# Altium project PUA.PrjPcb (part 8 of 14)

## Sheet Private_CPU_Reset_IO.SchDoc
size D
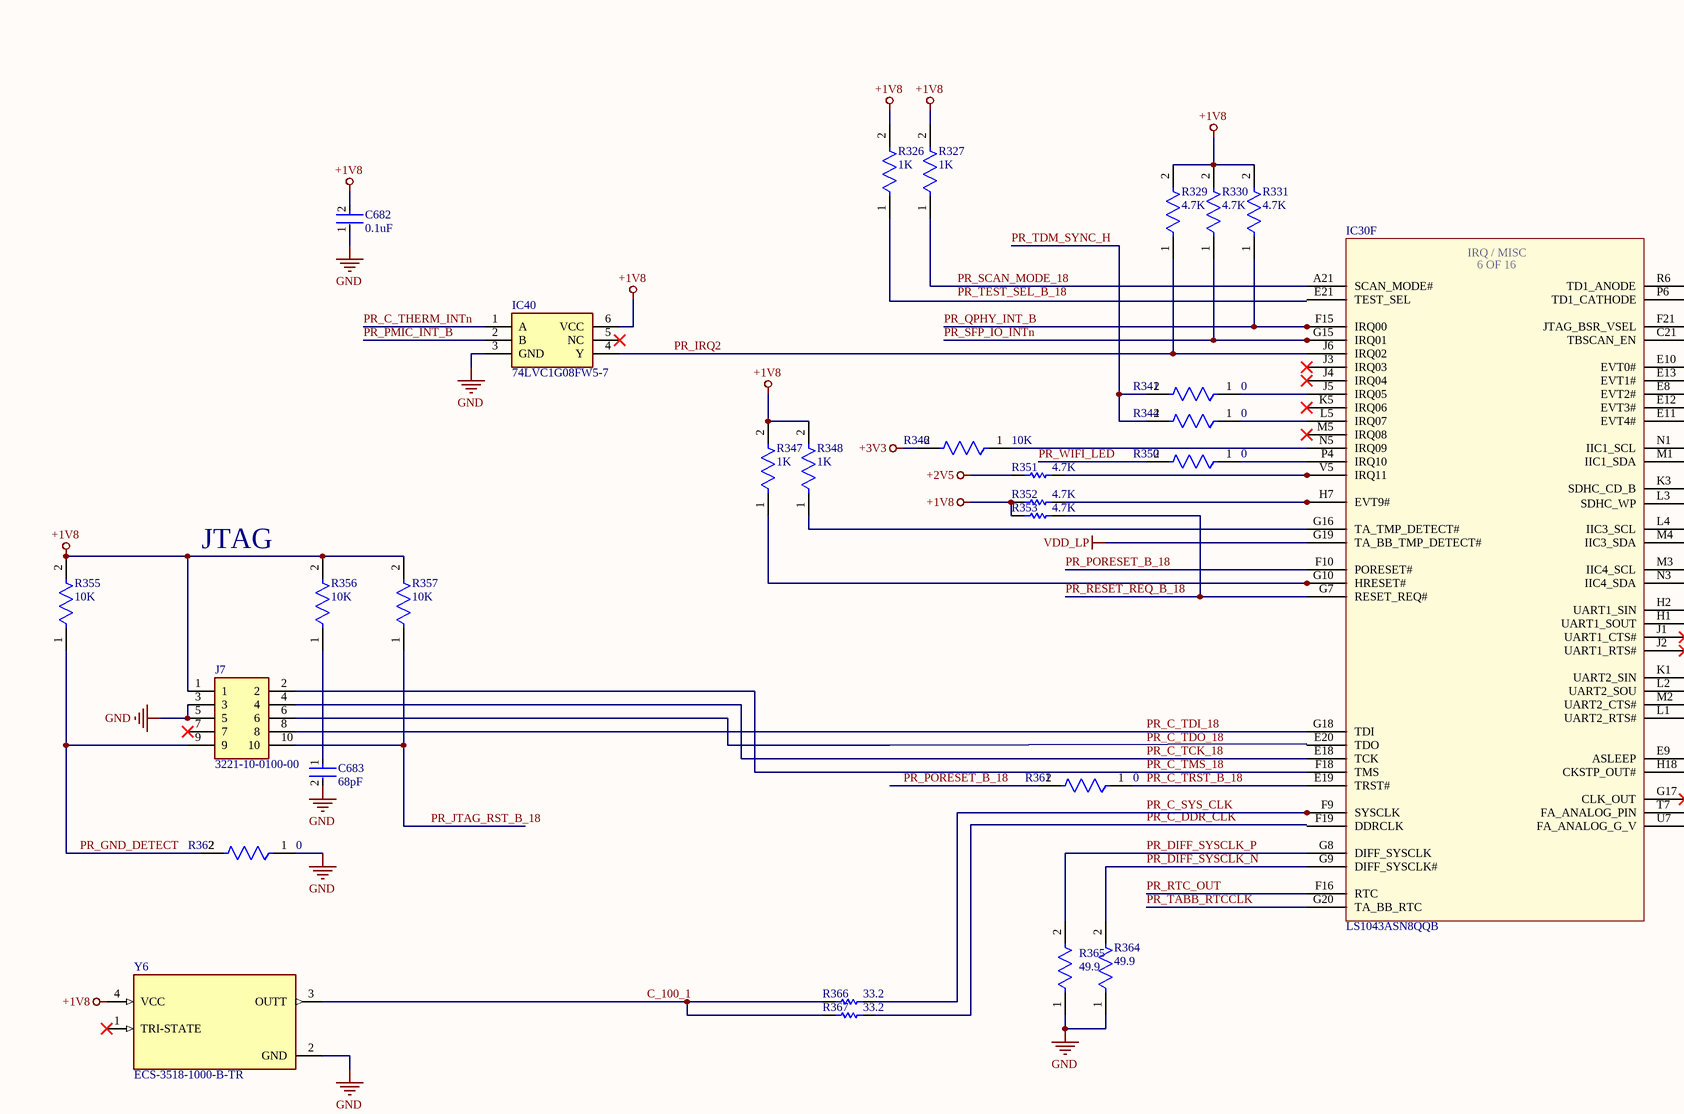
[diagram p32: Private_CPU_Reset_IO.SchDoc, top left]
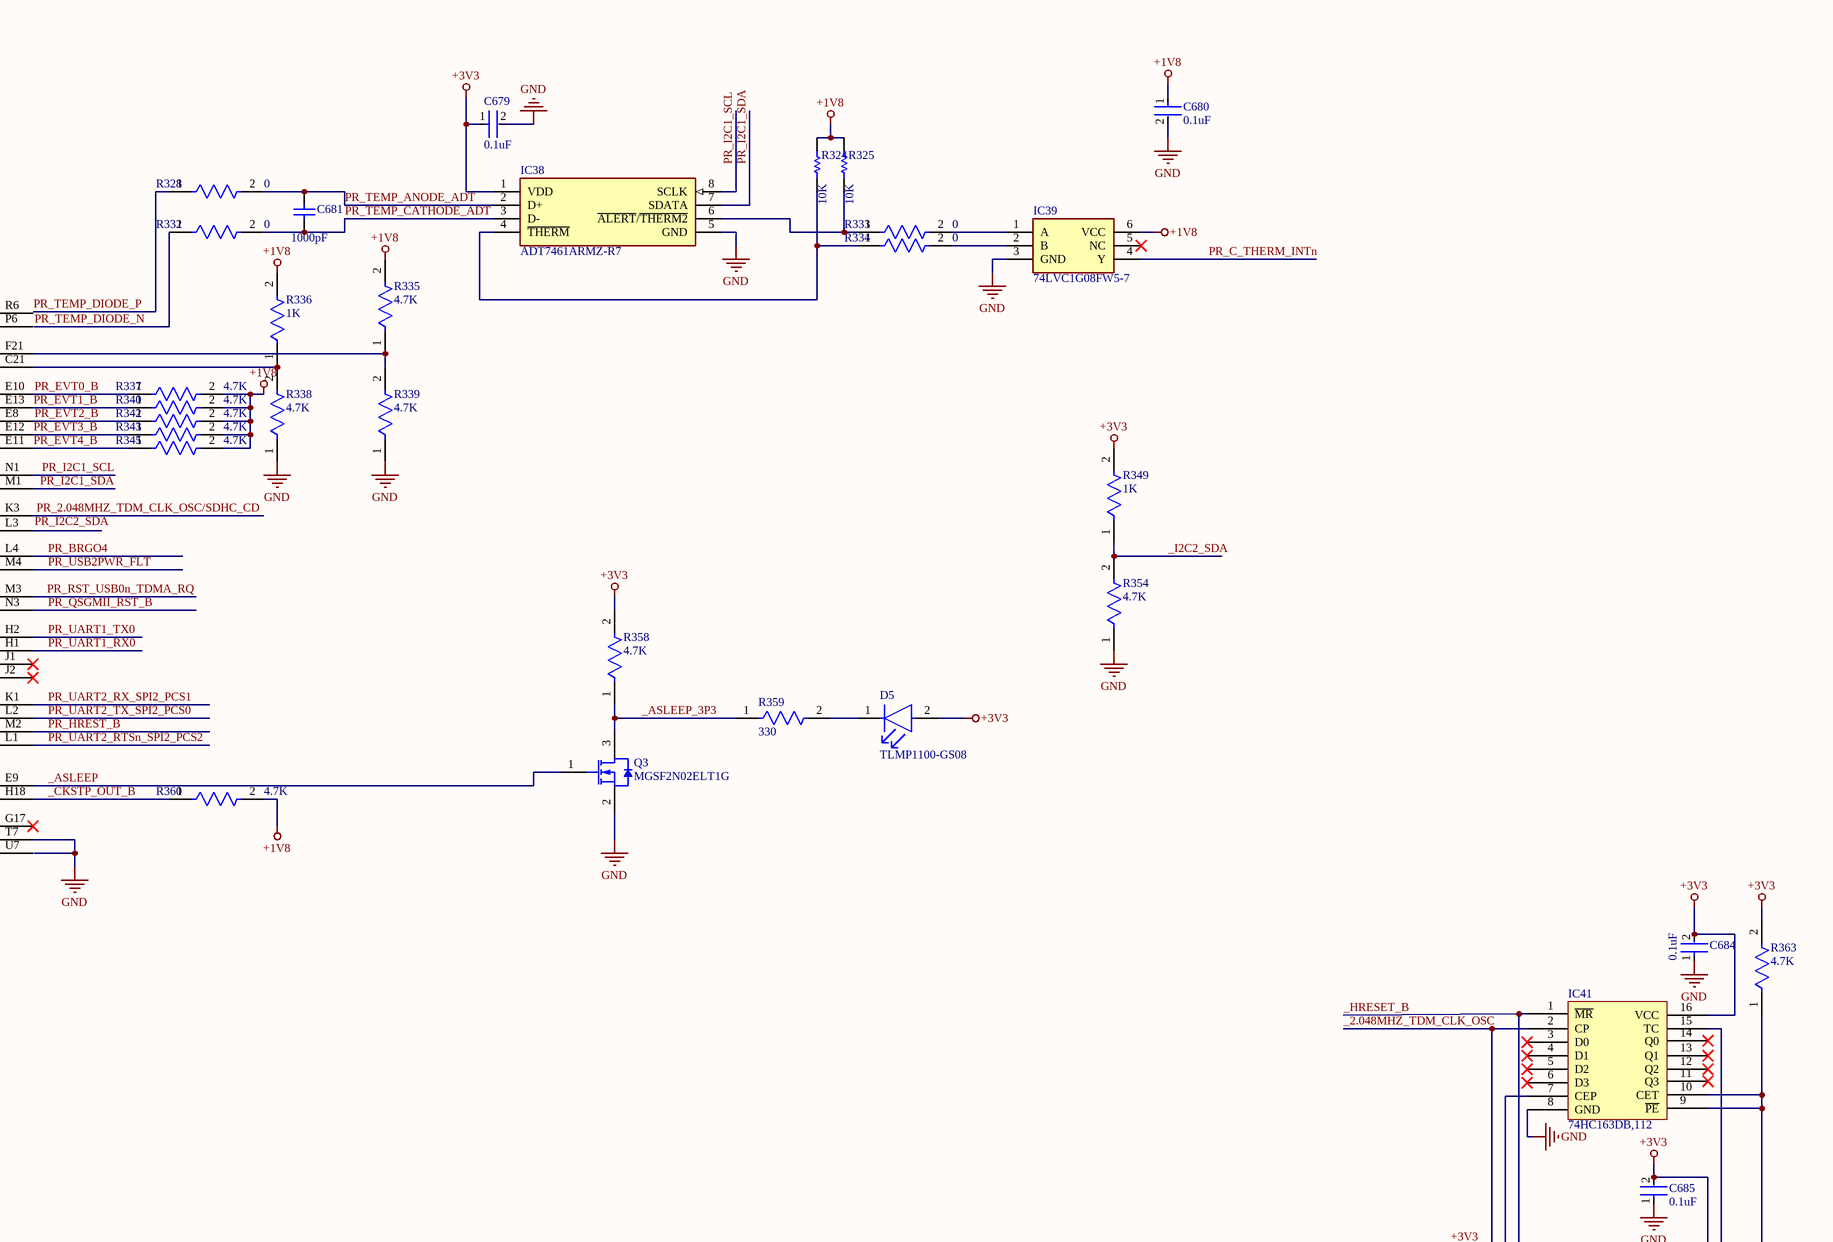
[diagram p33: Private_CPU_Reset_IO.SchDoc, top right]
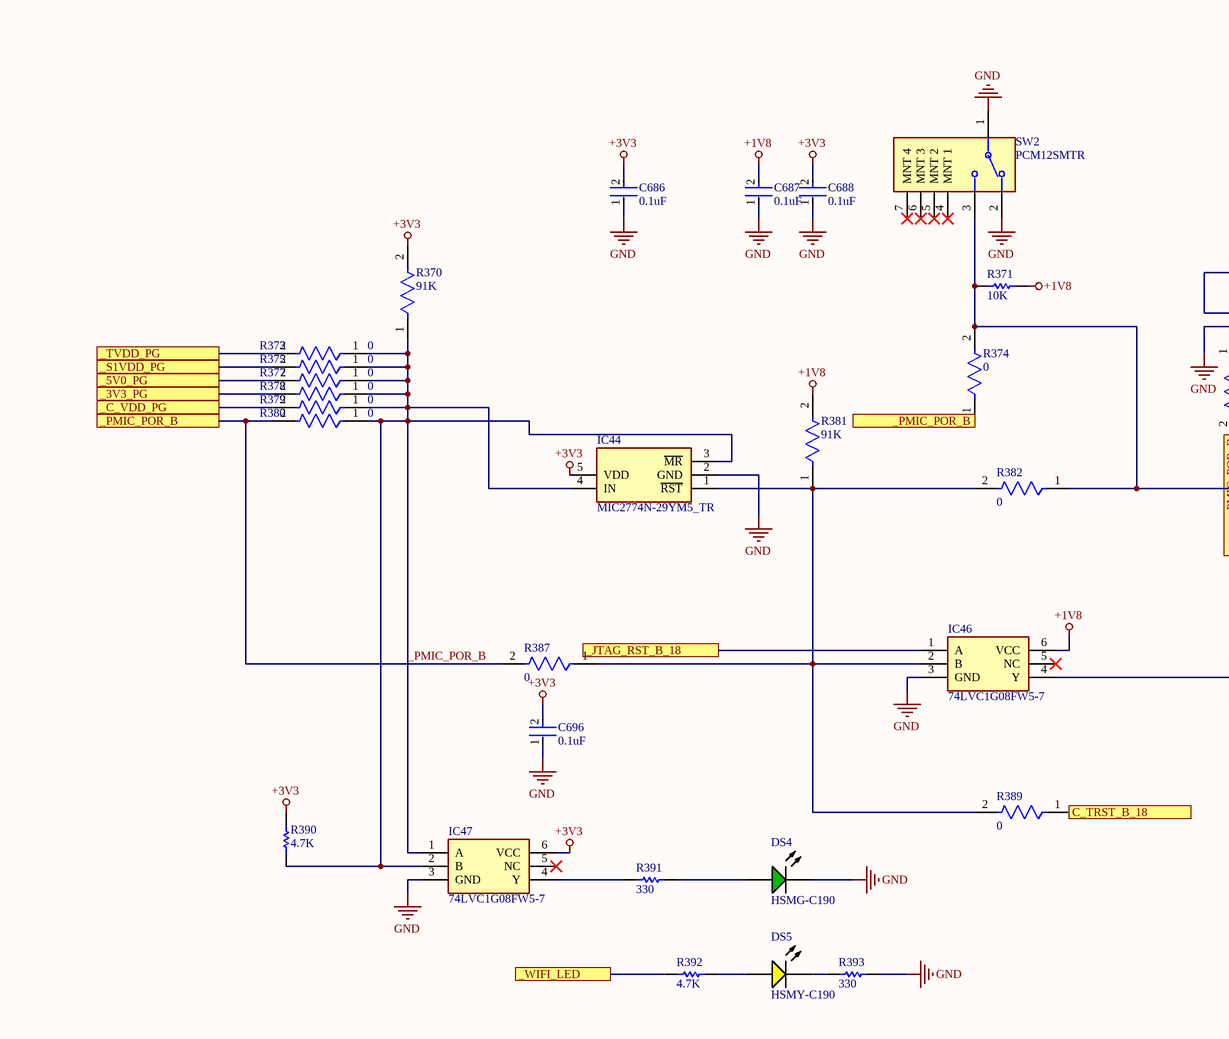
[diagram p34: Private_CPU_Reset_IO.SchDoc, bottom left]
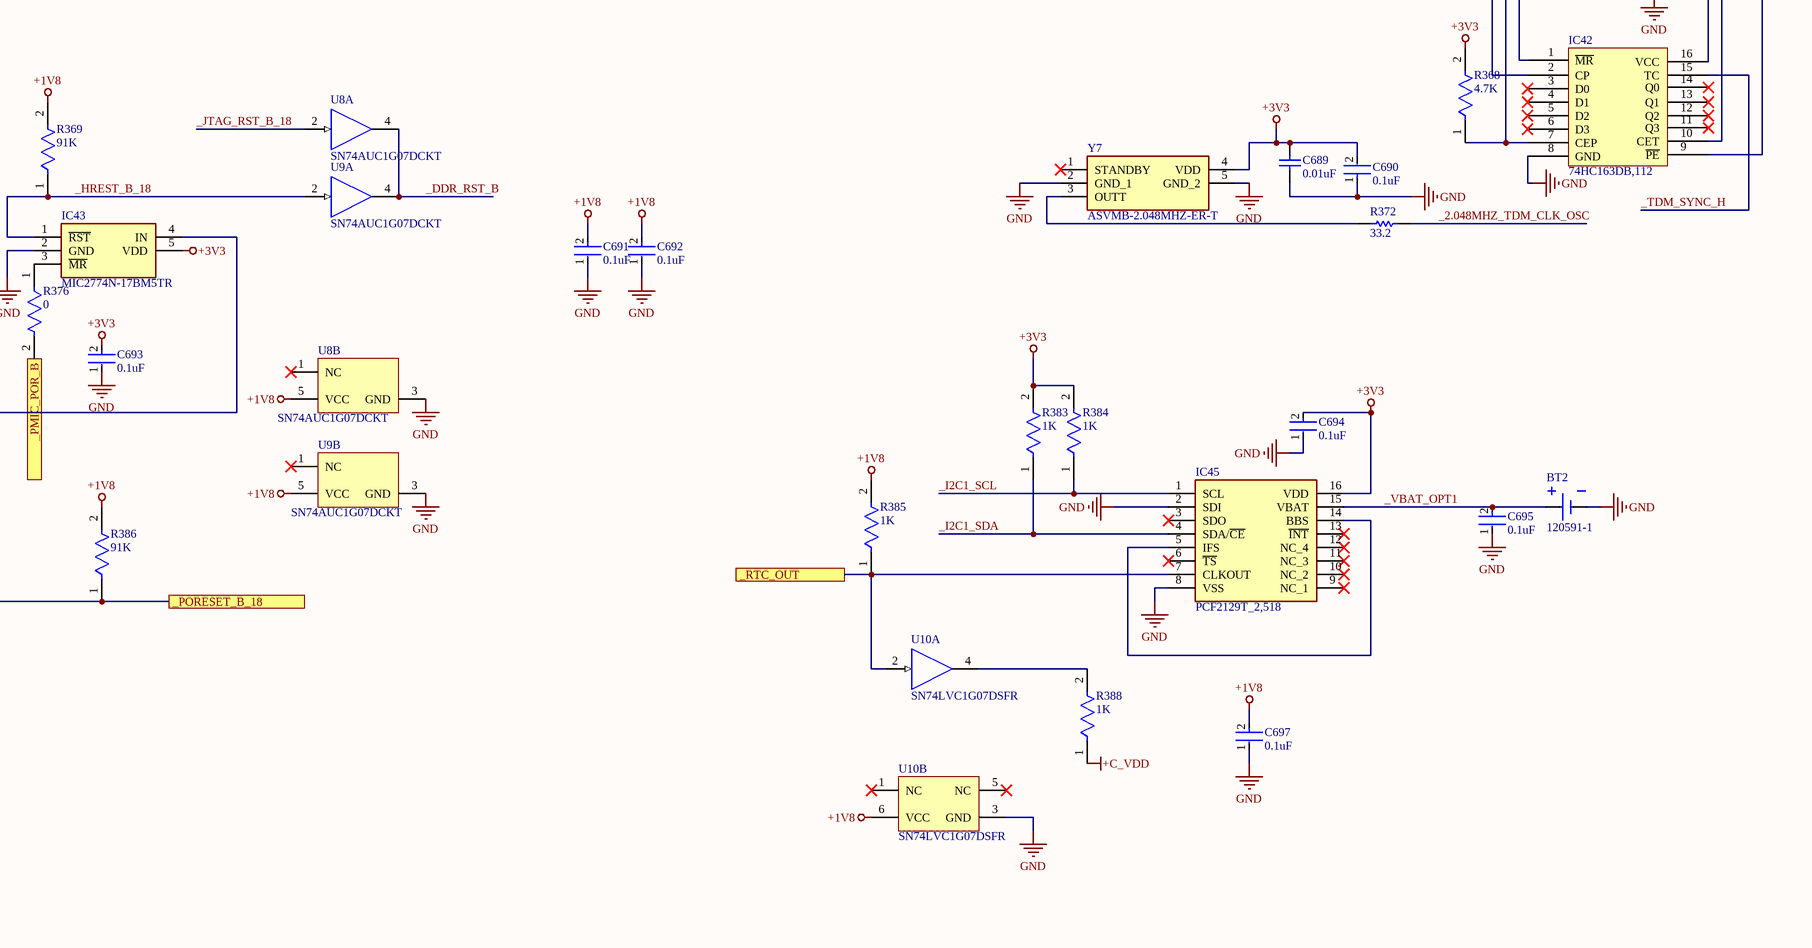
[diagram p35: Private_CPU_Reset_IO.SchDoc, bottom right]

### Parts
BT2  120591-1  [TECO-120591-1-2_V]
C679  0.1uF  [FP-C0402-BB-MFG]
C680  0.1uF  [FP-C0402-BB-MFG]
C681  1000pF  [CAPC1005X55X25ML5T10]
C682  0.1uF  [FP-GRM15-MFG]
C683  68pF  [FP-C0805C-DN-MFG]
C684  0.1uF  [FP-C0402-BB-MFG]
C685  0.1uF  [FP-C0402-BB-MFG]
C686  0.1uF  [FP-GRM15-MFG]
C687  0.1uF  [FP-GRM15-MFG]
C688  0.1uF  [FP-GRM15-MFG]
C689  0.01uF  [CAPC1005X56X25LL10T15]
C690  0.1uF  [FP-C0402-BB-MFG]
C691  0.1uF  [FP-GRM15-MFG]
C692  0.1uF  [FP-GRM15-MFG]
C693  0.1uF  [FP-GRM15-MFG]
C694  0.1uF  [FP-GRM15-MFG]
C695  0.1uF  [FP-GRM15-MFG]
C696  0.1uF  [FP-GRM15-MFG]
C697  0.1uF  [FP-GRM15-MFG]
D5  TLMP1100-GS08  [FP-6_541-5056_01-4-MFG]
DS4  HSMG-C190  [AVAG-HSMX-C190_V]
DS5  HSMY-C190  [AVAG-HSMX-C190_V]
IC30  LS1043ASN8QQB  [BGA780C80P28X28_2300X2300X261]  (part F of 16)
IC38  ADT7461ARMZ-R7  [SOP65P490X110-8N]
IC39  74LVC1G08FW5-7  [74LVC1G08FW57]
IC40  74LVC1G08FW5-7  [74LVC1G08FW57]
IC41  74HC163DB,112  [SOP65P775X200-16N]
IC42  74HC163DB,112  [SOP65P775X200-16N]
IC43  MIC2774N-17BM5TR  [SOT95P280X145-5N]
IC44  MIC2774N-29YM5_TR  [SOT95P280X145-5N]
IC45  PCF2129T_2,518  [SOIC127P1032X265-16N]
IC46  74LVC1G08FW5-7  [74LVC1G08FW57]
IC47  74LVC1G08FW5-7  [74LVC1G08FW57]
J7  3221-10-0100-00  [CNC_3221-10-0100-00]
Q3  MGSF2N02ELT1G  [ONSC-SOT-23-3-318-08_V]
R324  10K  [RESC1005X40X25NL05T05]
R325  10K  [RESC1005X40X25NL05T05]
R326  1K  [FP-CRCW0402-e3-MFG]
R327  1K  [FP-CRCW0402-e3-MFG]
R328  0  [FP-CRCW0402-e3-IPC_C]
R329  4.7K  [FP-CRCW0402-e3-IPC_B]
R330  4.7K  [FP-CRCW0402-e3-IPC_B]
R331  4.7K  [FP-CRCW0402-e3-IPC_B]
R332  0  [FP-CRCW0402-e3-IPC_C]
R333  0  [FP-CRCW0402-e3-IPC_C]
R334  0  [FP-CRCW0402-e3-IPC_C]
R335  4.7K  [FP-CRCW0402-e3-IPC_B]
R336  1K  [FP-CRCW0402-e3-MFG]
R337  4.7K  [FP-CRCW0402-e3-IPC_B]
R338  4.7K  [FP-CRCW0402-e3-IPC_B]
R339  4.7K  [FP-CRCW0402-e3-IPC_B]
R340  4.7K  [FP-CRCW0402-e3-IPC_B]
R341  0  [FP-CRCW0402-e3-IPC_C]
R342  4.7K  [FP-CRCW0402-e3-IPC_B]
R343  4.7K  [FP-CRCW0402-e3-IPC_B]
R344  0  [FP-CRCW0402-e3-IPC_C]
R345  4.7K  [FP-CRCW0402-e3-IPC_B]
R346  10K  [FP-CRCW0402-e3-IPC_B]
R347  1K  [FP-CRCW0402-e3-MFG]
R348  1K  [FP-CRCW0402-e3-MFG]
R349  1K  [FP-CRCW0402-e3-MFG]
R350  0  [FP-CRCW0402-e3-IPC_C]
R351  4.7K  [RESC1005X40X25LL05T05]
R352  4.7K  [RESC1005X40X25LL05T05]
R353  4.7K  [RESC1005X40X25LL05T05]
R354  4.7K  [FP-CRCW0402-e3-IPC_B]
R355  10K  [FP-CRCW0402-e3-IPC_B]
R356  10K  [FP-CRCW0402-e3-IPC_B]
R357  10K  [FP-CRCW0402-e3-IPC_B]
R358  4.7K  [FP-CRCW0402-e3-IPC_B]
R359  330  [FP-CRCW0402-e3-MFG]
R360  4.7K  [FP-CRCW0402-e3-IPC_B]
R361  0  [FP-CRCW0402-e3-IPC_C]
R362  0  [FP-CRCW0402-e3-IPC_C]
R363  4.7K  [FP-CRCW0402-e3-IPC_B]
R364  49.9  [FP-CRCW0402-e3-MFG]
R365  49.9  [FP-CRCW0402-e3-MFG]
R366  33.2  [RESC1005X40X25LL05T05]
R367  33.2  [RESC1005X40X25LL05T05]
R368  4.7K  [FP-CRCW0402-e3-IPC_B]
R369  91K  [FP-CRCW0402-e3-IPC_B]
R370  91K  [FP-CRCW0402-e3-IPC_B]
R371  10K  [RESC1005X40X25NL05T05]
R372  33.2  [RESC1005X40X25ML05T05]
R373  0  [FP-CRCW0402-e3-IPC_C]
R374  0  [FP-CRCW0402-e3-IPC_C]
R375  0  [FP-CRCW0402-e3-IPC_C]
R376  0  [FP-CRCW0402-e3-IPC_C]
R377  0  [FP-CRCW0402-e3-IPC_C]
R378  0  [FP-CRCW0402-e3-IPC_C]
R379  0  [FP-CRCW0402-e3-IPC_C]
R380  0  [FP-CRCW0402-e3-IPC_C]
R381  91K  [FP-CRCW0402-e3-IPC_B]
R382  0  [FP-CRCW0402-e3-IPC_C]
R383  1K  [FP-CRCW0402-e3-MFG]
R384  1K  [FP-CRCW0402-e3-MFG]
R385  1K  [FP-CRCW0402-e3-MFG]
R386  91K  [FP-CRCW0402-e3-IPC_B]
R387  0  [FP-CRCW0402-e3-IPC_C]
R388  1K  [FP-CRCW0402-e3-MFG]
R389  0  [FP-CRCW0402-e3-IPC_C]
R390  4.7K  [RESC1005X40X25LL05T05]
R391  330  [RESC1608X55X30LL15T15]
R392  4.7K  [RESC1005X40X25LL05T05]
R393  330  [RESC1608X55X30LL15T15]
SW2  PCM12SMTR  [FP-PCM12SMTR-MFG]
U8  SN74AUC1G07DCKT  [DCK0005A_M]  (parts A,B of 2)
U9  SN74AUC1G07DCKT  [DCK0005A_M]  (parts A,B of 2)
U10  SN74LVC1G07DSFR  [DSF0006A_V]  (parts A,B of 2)
Y6  ECS-3518-1000-B-TR  [OSC_ECS-3518-1000-B-TR]
Y7  ASVMB-2.048MHZ-ER-T  [ASVMB2048MHZERT]

### Ports
_3V3_PG, _5V0_PG, _C_VDD_PG, _JTAG_RST_B_18, _PMIC_POR_B, _PORESET_B_18, _RTC_OUT, _S1VDD_PG, _TVDD_PG, _WIFI_LED, C_TRST_B_18

### Nets
+1V8: C680.1 C682.2 C687.2 C691.2 C692.2 C697.2 IC39.6(VCC) IC40.6(VCC) IC46.6(VCC) J7.1 R324.2 R325.2 R326.2 R327.2 R329.2 R330.2 R331.2 R335.2 R336.2 R337.2 R340.2 R342.2 R343.2 R345.2 R347.2 R348.2 R352.2 R353.2 R355.2 R356.2 R357.2 R360.2 R369.2 R371.1 R381.2 R385.2 R386.2 U8.5(VCC) U9.5(VCC) U10.6(VCC) Y6.4(VCC)
+2V5: R351.2
+3V3: C679.1 C684.2 C685.2 C686.2 C688.2 C689.2 C690.2 C693.2 C694.2 C696.2 D5.2(A) IC38.1(VDD) IC41.16(VCC) IC42.16(VCC) IC43.5(VDD) IC44.5(VDD) IC45.16(VDD) IC47.6(VCC) R346.2 R349.2 R358.2 R363.2 R368.2 R370.2 R383.2 R384.2 R390.2 Y7.4(VDD)
+C_VDD: R388.1
GND: BT2.2(-) C679.2 C680.2 C682.1 C683.2 C684.1 C685.1 C686.1 C687.1 C688.1 C689.1 C690.1 C691.1 C692.1 C693.1 C694.1 C695.1 C696.1 C697.1 DS4.2(K) IC30.T7(FA_ANALOG_PIN) IC38.5(GND) IC39.3(GND) IC40.3(GND) IC41.8(GND) IC42.8(GND) IC43.2(GND) IC44.2(GND) IC45.2(SDI) IC45.8(VSS) IC46.3(GND) IC47.3(GND) J7.3 J7.5 Q3.2(S) R338.1 R339.1 R354.1 R362.1 R364.1 R365.1 R393.2 SW2.1 SW2.2 U8.3(GND) U9.3(GND) U10.3(GND) Y6.2(GND) Y7.2(GND_1) Y7.5(GND_2)
VDD_LP: IC30.G19(TA_BB_TMP_DETECT#)
_2.048MHZ_TDM_CLK_OSC: IC41.2(CP) IC42.2(CP) R372.2
_ASLEEP: IC30.E9(ASLEEP) Q3.1(G)
_ASLEEP_3P3: Q3.3(D) R358.1 R359.1
_CKSTP_OUT_B: IC30.H18(CKSTP_OUT#) R360.1
_DDR_RST_B: U8.4(Y) U9.4(Y)
_HRESET_B: IC41.1(~{MR}) IC42.1(~{MR})
_HREST_B_18: IC43.1(~{RST}) R369.1 U9.2(A)
_I2C1_SCL: IC45.1(SCL) R384.1
_I2C1_SDA: IC45.4(SDA/~{CE}) R383.1
_I2C2_SDA: R349.1 R354.2
_JTAG_RST_B_18: U8.2(A)
_PMIC_POR_B: IC44.3(~{MR}) IC44.4(IN) IC47.1(A) IC47.2(B) R370.1 R373.1 R374.1 R375.1 R376.2 R377.1 R378.1 R379.1 R380.1 R380.2 R387.2 R390.1 ; port _PMIC_POR_B
_TDM_SYNC_H: IC42.15(TC)
_VBAT_OPT1: BT2.1(+) C695.2 IC45.15(VBAT)
C_100_1: R366.1 R367.1 Y6.3(OUTT)
PR_2.048MHZ_TDM_CLK_OSC/SDHC_CD: IC30.K3(SDHC_CD_B)
PR_BRGO4: IC30.L4(IIC3_SCL)
PR_C_DDR_CLK: R367.2
PR_C_SYS_CLK: IC30.F9(SYSCLK) R366.2
PR_C_TCK_18: IC30.E18(TCK) J7.4
PR_C_TDI_18: IC30.G18(TDI) J7.8
PR_C_THERM_INTn: IC39.4(Y) IC40.1(A)
PR_C_TMS_18: IC30.F18(TMS) J7.2
PR_C_TRST_B_18: IC30.E19(TRST#) R361.1
PR_DIFF_SYSCLK_N: IC30.G9(DIFF_SYSCLK#) R364.2
PR_DIFF_SYSCLK_P: IC30.G8(DIFF_SYSCLK) R365.2
PR_EVT0_B: IC30.E10(EVT0#) R337.1
PR_EVT1_B: IC30.E13(EVT1#) R340.1
PR_EVT2_B: IC30.E8(EVT2#) R342.1
PR_EVT3_B: IC30.E12(EVT3#) R343.1
PR_EVT4_B: IC30.E11(EVT4#) R345.1
PR_GND_DETECT: J7.9 R355.1 R362.2
PR_HREST_B: IC30.M2(UART2_CTS#)
PR_I2C1_SCL: IC30.N1(IIC1_SCL) IC38.8(SCLK)
PR_I2C1_SDA: IC30.M1(IIC1_SDA) IC38.7(SDATA)
PR_IRQ2: IC30.J6(IRQ02) IC40.4(Y) R329.1
PR_JTAG_RST_B_18: J7.10 R357.1
PR_PMIC_INT_B: IC40.2(B)
PR_PORESET_B_18: IC30.F10(PORESET#) R361.2
PR_QPHY_INT_B: IC30.F15(IRQ00) R331.1
PR_QSGMII_RST_B: IC30.N3(IIC4_SDA)
PR_RESET_REQ_B_18: IC30.G7(RESET_REQ#) R353.1
PR_RST_USB0n_TDMA_RQ: IC30.M3(IIC4_SCL)
PR_RTC_OUT: IC30.F16(RTC)
PR_SCAN_MODE_18: IC30.A21(SCAN_MODE#) R327.1
PR_SFP_IO_INTn: IC30.G15(IRQ01) R330.1
PR_TABB_RTCCLK: IC30.G20(TA_BB_RTC)
PR_TDM_SYNC_H: R341.2 R344.2
PR_TEMP_ANODE_ADT: C681.2 IC38.2(D+) R328.2
PR_TEMP_CATHODE_ADT: C681.1 IC38.3(D-) R332.2
PR_TEMP_DIODE_N: R332.1
PR_TEMP_DIODE_P: R328.1
PR_UART1_RX0: IC30.H1(UART1_SOUT)
PR_UART1_TX0: IC30.H2(UART1_SIN)
PR_UART2_RTSn_SPI2_PCS2: IC30.L1(UART2_RTS#)
PR_UART2_RX_SPI2_PCS1: IC30.K1(UART2_SIN)
PR_UART2_TX_SPI2_PCS0: IC30.L2(UART2_SOU)
PR_USB2PWR_FLT: IC30.M4(IIC3_SDA)
PR_WIFI_LED: R350.2
NetC683_1: C683.1 R356.1
NetD5_1: D5.1(C) R359.2
NetDS4_1: DS4.1(A) R391.2
NetDS5_1: DS5.1(A) R392.1
NetDS5_2: DS5.2(K) R393.1
NetIC30_C21: IC30.C21(TBSCAN_EN) R336.1 R338.2
NetIC30_F21: IC30.F21(JTAG_BSR_VSEL) R335.1 R339.2
NetIC30_G10: IC30.G10(HRESET#) R347.1
NetIC30_G16: IC30.G16(TA_TMP_DETECT#) R348.1
NetIC30_H7: IC30.H7(EVT9#) R352.1
NetIC30_J5: IC30.J5(IRQ05) R341.1
NetIC30_L5: IC30.L5(IRQ07) R344.1
NetIC30_N5: IC30.N5(IRQ09) R346.1
NetIC30_P4: IC30.P4(IRQ10) R350.1
NetIC30_V5: IC30.V5(IRQ11) R351.1
NetIC38_4: IC38.4(~{THERM}) R324.1 R334.1
NetIC38_6: IC38.6(~{ALERT}/~{THERM2}) R325.1 R333.1
NetIC39_1: IC39.1(A) R333.2
NetIC39_2: IC39.2(B) R334.2
NetIC41_7: IC41.7(CEP) IC42.7(CEP) R368.1
NetIC41_9: IC41.9(~{PE}) IC41.10(CET) IC42.9(~{PE}) R363.1
NetIC41_15: IC41.15(TC) IC42.10(CET)
NetIC43_3: IC43.3(~{MR}) R376.1
NetIC43_4: IC43.4(IN) R371.2 R374.2 R382.1 SW2.3
NetIC44_1: IC44.1(~{RST}) IC46.2(B) R381.1 R382.2 R387.1 R389.2
NetIC45_5: IC45.5(IFS) IC45.14(BBS)
NetIC45_7: IC45.7(CLKOUT) R385.1 U10.2(A) ; port _RTC_OUT
NetIC46_1: IC46.1(A) ; port _JTAG_RST_B_18
NetIC46_4: IC46.4(Y) R386.1 ; port _PORESET_B_18
NetIC47_4: IC47.4(Y) R391.1
NetR372_1: R372.1 Y7.3(OUTT)
NetR373_2: R373.2 ; port _TVDD_PG
NetR375_2: R375.2 ; port _S1VDD_PG
NetR377_2: R377.2 ; port _5V0_PG
NetR378_2: R378.2 ; port _3V3_PG
NetR379_2: R379.2 ; port _C_VDD_PG
NetR388_2: R388.2 U10.4(Y)
NetR389_1: R389.1 ; port C_TRST_B_18
NetR392_2: R392.2 ; port _WIFI_LED

Not connected (* = marked no-connect by the designer): IC30 E20(TDO) E21(TEST_SEL) F19(DDRCLK) G17(CLK_OUT)* J1(UART1_CTS#)* J2(UART1_RTS#)* J3(IRQ03)* J4(IRQ04)* K5(IRQ06)* L3(SDHC_WP) M5(IRQ08)* P6(TD1_CATHODE) R6(TD1_ANODE) U7(FA_ANALOG_G_V); IC39 5(NC)*; IC40 5(NC)*; IC41 3(D0)* 4(D1)* 5(D2)* 6(D3)* 11(Q3)* 12(Q2)* 13(Q1)* 14(Q0)*; IC42 3(D0)* 4(D1)* 5(D2)* 6(D3)* 11(Q3)* 12(Q2)* 13(Q1)* 14(Q0)*; IC45 3(SDO)* 6(~{TS})* 9(NC_1)* 10(NC_2)* 11(NC_3)* 12(NC_4)* 13(~{INT})*; IC46 5(NC)*; IC47 5(NC)*; J7 6 7*; R326 1; SW2 4(MNT_1)* 5(MNT_2)* 6(MNT_3)* 7(MNT_4)*; U8 1(NC)*; U9 1(NC)*; U10 1(NC)* 5(NC)*; Y6 1(TRI-STATE)*; Y7 1(STANDBY)*

### Notes on the sheet
- JTAG
- Labels drawn without touching a wire or pin: PR_C_TDO_18, PR_I2C2_SDA, PR_TEST_SEL_B_18
- Title
- Size:
- Date:
- File:
- D
- Number:
- Time:
- Revision:
- Sheet
- of
- (in symbol LS1043ASN8QQB, part F) IRQ / MISC; 6 OF 16

### Library data of the parts
BT2 = CMP-0438-00001-2: Lithium Battery Holder for CR2032 3V Cell; Manufacturer: TE Connectivity; Packing Type: Tray; Body Shape: Horizontal Cylindrical; AccessRights: 2147483647; RevisionId: 1; Folder: Unified Components\Components\TE Connectivity\Connectors & Connector Components\Power Products\Battery Interconnection Products\; ContentType: Unified Component; ContentTypeGUID: CB3C11C4-E317-11DF-B822-12313F0024A2; ComponentLink1Description: Manufacturer URL; LifeCycleStateGUID: 61E382EE-6656-4F12-9E24-BE9327104A25; FolderGUID: A6761B51-D489-48A3-9180-F4808F45AB79; PartNumber: 120591-1; LifeCycle: Released; ReleaseDate: 20/08/2013 02:50:22 AM; PackageReference: 120591-1; ComponentLink2URL: http://www.te.com/commerce/DocumentDelivery/DDEController?Action=showdoc&DocId=Customer+Drawing%7F120591%7FH%7Fpdf%7FEnglish%7FENG_CD_120591_H.pdf%7F120591-1; DatasheetVersion: Rev. H, 01/2013; PackageDescription: Lithium Battery Holder; ItemGUID: B2C50140-681E-4F62-8DBB-9728605318CE; ItemHRID: CMP-0438-00001; Mounting Technology: Through Hole; ComponentLink1URL: http://www.te.com/; ComponentLink2Description: Datasheet
C679 C680 C684 C685 C690 = CMP-2008-02046-2: CAP CER 0.1UF 10V X5R 0402; Manufacturer: Kemet; Manufacturer Part Number: C0402C104K8PACTU; Material: Ceramic; Capacitance: 0.10 μF; Temperature Coefficient: 15%; Tolerance: 0.1; Value: 0.10 μF; Package: C0402-BB; Temperature: -55°C to +125°C; ComponentLink2Description: Datasheet; Temperature Characteristic: X5R; Device Class L1: Passive Components; Height: 0.55mm; Lead Free: Yes; ComponentLink2URL: https://content.kemet.com/datasheets/KEM_C1002_X7R_SMD.pdf; Device Class L2: Capacitors; Temperature Range Low: -55°C; Temperature Range High: +125°C; RoHS: TRUE; Octopart: https://octopart.com/c0402c104k8pactu-kemet-140039; Automotive: No; Mouser Description: Capacitor 100 nF 10 VDC 0402; Category: Cap; Voltage Rating: 10 V; Digikey Description: CAP CER 0.1UF 10V X5R 0402; Ipc Land Pattern Name: CAPC10050X50; Device Class L3: Ceramic Capacitors
C681 = CMP-1662-00017-1: Chip Capacitor, 1 nF, +/- 10%, 50 V, -55 to 125 degC, 0402 (1005 Metric), RoHS, Tape and Reel; Case\/Package: 0402; Type (Capacitors): X7R; Voltage Rating (DC): 50 V; Capacitance: 1 nF; Width: 0.5 mm; Pins: 2; REACH SVHC: No SVHC; Length: 1 mm; Height: 0.5 mm; PackageDescription: 2-Pin Surface Mount Device, Body 1 x 0.5 mm; DatasheetVersion: 07/2016; Mount: Surface Mount; ComponentLink2Description: Datasheet; Tolerance: 10%; ComponentLink2URL: http://psearch.en.murata.com/capacitor/product/GRM155R71H102KA01%23.pdf; ComponentLink1URL: http://www.murata.com/; Case Code (Metric): 1005; Package Quantity: 10000; Min Operating Temperature: -55 degC; Max Operating Temperature: 125 degC; Voltage Rating: 50 V; ComponentLink1Description: Manufacturer URL; Packaging: Tape and Reel; Radiation Hardening: No; RoHSCompliant: true; PackageReference: 0402; Mounting Technology: Surface Mount; Case Code (Imperial): 0402
C682 C686-C688 C691-C697 = CMP-2100-03641-2: as C391 on sheet Private_CPU_Power; RoHS: TRUE; Temperature Characteristic: X7R; Octopart: https://octopart.com/grm155r71c104ka88d-murata-196880; Digikey Description: CAP CER 0.1UF 16V X7R 0402; Device Class L3: Ceramic Capacitors; Height: 0.55mm; ComponentLink2Description: Datasheet; Temperature Range Low: -55°C; Ipc Land Pattern Name: CAPC10050X219; ComponentLink2URL: https://search.murata.co.jp/Ceramy/image/img/A01X/G101/ENG/GRM155R71H471KA01-01A.pdf; Device Class L1: Passive Components; Lead Free: yes; Category: Cap; Package: GRM15; Temperature: -55°C to +125°C; Device Class L2: Capacitors; Temperature Range High: +125°C; Mouser Description: 0402 0.1 uF 16V ±10 % Tolerance X7R SMT Multilayer Ceramic Capacitor
C683 = CMP-2007-00438-2: CAP CER 68PF 50V C0G/NP0 0805; Manufacturer Part Number: C0805C680J5GACTU; Manufacturer: KEMET; Temperature Coefficient: 30ppm/°C; Tolerance: 0.05; Temperature Characteristic: C0G; Material: Ceramic; ComponentLink2URL: https://content.kemet.com/datasheets/KEM_C1003_C0G_SMD.pdf; Device Class L1: Passive Components; Device Class L2: Capacitors; Capacitance: 68 pF; Value: 68 pF; Category: Cap; Octopart: https://octopart.com/c0805c680j5gactu-kemet-130145; Digikey Description: CAP CER 68PF 50V C0G/NP0 0805; Voltage Rating: 50 V; Ipc Land Pattern Name: CAPC200125X78; Lead Free: Yes; RoHS: TRUE; Device Class L3: Ceramic Capacitors; Mouser Description: Multilayer Ceramic Capacitors MLCC - SMD/SMT 50volts 68pF C0G 5%; Temperature Range High: +125°C; Temperature Range Low: -55°C; Height: 0.88mm; Temperature: -55°C to +125°C; ComponentLink2Description: Datasheet; Automotive: No; Package: C0805C-DN
C689 = CMP-2008-02796-1: Manufacturer: AVX Interconnect / Elco; Part Number: 0402YC103JAT2A
D5 = CMP-02520-000009-1: LED GREEN 0603 SMD; Manufacturer: Vishay; Max Junction Temp: +120°C; Automotive Grade: Grade 3; Reverse Voltage: 6V; Led Orientation: Top View; Forward Voltage: 2.1V; Luminous Intensity: 15mcd; Forward Current: 20mA; Colour: Pure green; Peak Emmision Wavelength: 562nm; Wavelength: 561nm; Viewing Angle: 160°; Power Dissipation: 90mW; Digikey Description: LED GREEN 0603 SMD; Package: 6.541-5056.01-4; Ambient Temperature Range High: +100°C; Height: 0.65mm; Device Class L1: Optoelectronics; Device Class L2: LEDs; Mouser Description: Standard LEDs - SMD Pure Green; Temperature Range High: +120°C; RoHS: TRUE; Ambient Temperature Range Low: -40°C; Temperature: to +120°C; Manufacturer Part Number: TLMP1100-GS08; ComponentLink2URL: http://www.vishay.com/docs/83173/tlmb1100.pdf; Lead Free: Yes; Octopart: https://octopart.com/tlmp1100-gs08-vishay-55433993; Automotive: Yes; Device Class L3: unset; ComponentLink2Description: Datasheet; Category: Diode
DS4 = CMP-1744-00002-1: Chip LED, Green, 2.2 V, -40 to 85 degC, 2-Pin SMD, RoHS, Tape and Reel; Frequency: 400 KHz; Max Supply Voltage: 5.5 V; Access Time: 3500 ns; Clock Frequency: 100 KHz; Case\Package: SOIC; Density: 32 kb; Nominal Supply Current: 2 mA; Interface: Serial; Min Supply Voltage: 1.7 V; Packaging: Tape and Reel; PackageReference: HSMX-C190; ComponentLink2URL: http://docs.avagotech.com/docs/AV02-0551EN; RoHSCompliant: true; Pins: 8; REACH SVHC: No SVHC; Max Operating Temperature: 85 degC; Width: 4 mm; Radiation Hardening: No; Package Quantity: 3000; ComponentLink3Description: Package Specification; ComponentLink1Description: Manufacturer URL; Min Operating Temperature: -40 degC; PackageDescription: 2-Pin Surface Mount Device, Body 1.6 x 0.8 mm, Height 0.9 mm; Max Clock Frequency: 100 KHz; Height: 1.5 mm; ComponentLink1URL: http://www.avagotech.com/; DatasheetVersion: Mar-12; ComponentLink2Description: Datasheet; Mount: Surface Mount; Length: 5 mm; ComponentLink3URL: http://www.fairchildsemi.com/dwg/MA/MA03D.pdf
DS5 = CMP-1744-00003-1: LED Uni-Color Yellow, 65 mW, 20 mA, -40 to 85 degC, 2-Pin SMD, RoHS, Tape and Reel; Tolerance: 1%; Voltage Rating: 50 V; Power Rating: 100 mW; Case\Package: 0603; Resistance: 390 Ohm; Min Operating Temperature: -55 degC; Length: 1.6 mm; ComponentLink3Description: Package Specification; Mount: Surface Mount; PackageReference: HSMX-C190; ComponentLink2Description: Datasheet; DatasheetVersion: Mar-12; Case Code (Metric): 1608; Pins: 2; Package Quantity: 5000; ComponentLink2URL: http://docs.avagotech.com/docs/AV02-0551EN; ComponentLink1Description: Manufacturer URL; RoHSCompliant: true; Packaging: Tape and Reel; PackageDescription: 2-Pin Surface Mount Device, Body 1.6 x 0.8 mm, Height 0.9 mm; REACH SVHC: No SVHC; ComponentLink3URL: http://www.fairchildsemi.com/dwg/MA/MA03D.pdf; Voltage Rating (DC): 50 V; Width: 0.8 mm; ComponentLink1URL: http://www.avagotech.com/; Max Operating Temperature: 155 degC; Case Code (Imperial): 0603; Height: 0.45 mm
IC30 = LS1043ASN8QQB: as IC30 on sheet Private_CPU_Power; Datasheet Link: http://www.nxp.com/secured/assets/documents/en/data-sheet/LS1088A.pdf; Height: 2.61mm; Manufacturer_Part_Number: LS1043ASN8QQB; Mouser Part Number: 771-LS1043ASN8QQB; Mouser Price/Stock: https://www.mouser.co.uk/ProductDetail/NXP-Semiconductors/LS1043ASN8QQB/?qs=AQlKX63v8RsTATOTx7X0Jg%3D%3D
IC38 = ADT7461ARMZ-R7: Integrated Circuit; Manufacturer_Name: ON Semiconductor; Datasheet Link: http://www.onsemi.com/pub/Collateral/ADT7461-D.PDF; Height: 1.1mm; Manufacturer_Part_Number: ADT7461ARMZ-R7; Mouser Part Number: 863-ADT7461ARMZ-R7; Mouser Price/Stock: https://www.mouser.co.uk/ProductDetail/ON-Semiconductor/ADT7461ARMZ-R7/?qs=t2BMfLoP1KTcbdCoNjA9Gw%3D%3D; Arrow Part Number: ADT7461ARMZ-R7; Arrow Price/Stock: https://www.arrow.com/en/products/adt7461armz-r7/on-semiconductor
IC39 IC40 IC46 IC47 = 74LVC1G08FW5-7: Integrated Circuit; Manufacturer_Name: Diodes Inc.; Datasheet Link: https://www.diodes.com/assets/Datasheets/74LVC1G08.pdf; Height: 0.5mm; Manufacturer_Part_Number: 74LVC1G08FW5-7; Mouser Part Number: 621-74LVC1G08FW5-7; Mouser Price/Stock: https://www.mouser.co.uk/ProductDetail/Diodes-Incorporated/74LVC1G08FW5-7?qs=mYAa4mSiDJyHmkX79TXrAg%3D%3D; Arrow Part Number: 74LVC1G08FW5-7; Arrow Price/Stock: https://www.arrow.com/en/products/74lvc1g08fw5-7/diodes-incorporated
IC41 IC42 = 74HC163DB,112: Integrated Circuit; Manufacturer_Name: Nexperia; Datasheet Link: https://assets.nexperia.com/documents/data-sheet/74HC_HCT163.pdf; Height: 2mm; Manufacturer_Part_Number: 74HC163DB,112; Mouser Part Number: 771-HC163DB112; Mouser Price/Stock: https://www.mouser.com/Search/Refine.aspx?Keyword=771-HC163DB112; Arrow Part Number: 74HC163DB,112; Arrow Price/Stock: https://www.arrow.com/en/products/74hc163db112/nexperia
IC43 = MIC2774N-17BM5TR: Integrated Circuit; Manufacturer_Name: Microchip; Datasheet Link: http://ww1.microchip.com/downloads/en/DeviceDoc/mic2774.pdf; Height: 1.45mm; Manufacturer_Part_Number: MIC2774N-17BM5TR
IC44 = MIC2774N-29YM5_TR: Integrated Circuit; Manufacturer_Name: Microchip; Manufacturer_Part_Number: MIC2774N-29YM5 TR; Datasheet Link: https://eu.mouser.com/datasheet/2/268/mic2774-1891105.pdf; Height: 1.45mm
IC45 = PCF2129T_2,518: Integrated Circuit; Manufacturer_Name: NXP; Manufacturer_Part_Number: PCF2129T/2,518; Datasheet Link: http://www.nxp.com/docs/en/data-sheet/PCF2129.pdf; Height: 2.65mm; Mouser Part Number: 771-PCF2129T/2,518; Mouser Price/Stock: https://www.mouser.co.uk/ProductDetail/NXP-Semiconductors/PCF2129T-2518/?qs=O0BhuZj9Wkzo98h9NloC7Q%3D%3D; Arrow Part Number: PCF2129T/2,518; Arrow Price/Stock: https://www.arrow.com/en/products/pcf2129t2518/nxp-semiconductors
J7 = 3221-10-0100-00: Idc Box Header .050" 10pos; MF: {'manufacturer': u'CNC Tech'}; Value: *; Package: None; Price: None; MP: 3221-10-0100-00; Availability: Unavailable
Q3 = CMP-1058-00775-1: Power MOSFET, 2.8 A, 20 V, N-Channel, 3-Pin SOT-23, Pb-Free, Tape and Reel; Manufacturer: On Semiconductor; Crss Typ (pF): 45; Configuration: Single; V(BR)DSS Min (V): 20; ID Max (A): 2.8; Channel Polarity: N Channel; Ciss Typ (pF): 150; PD Max (W): 1.25; VGS Max (V): 8; Qrr Typ (nC): 200; Coss Typ (pF): 130; VGS(th) Max (V): 1; PartNumber: MGSF2N02ELT1G; ComponentLink3Description: Package Specification; ComponentLink1URL: http://www.onsemi.com/; ComponentLink3URL: http://www.onsemi.cn/pub_link/Collateral/318-08.PDF; DatasheetVersion: Rev. 3; Mounting Technology: Surface Mount; PackageVersion: Rev. AP, 11/2009; PackageDescription: 3-Pin Small Outline Transistor, Body 2.92 x 1.3 mm, Pitch 0.95 mm; ComponentLink1Description: Manufacturer URL; ComponentLink2URL: http://www.onsemi.cn/pub_link/Collateral/MGSF2N02EL-D.PDF; RoHS: Pb-Free; ComponentLink2Description: Datasheet; PackageReference: SOT-23-3-318-08; Package Type: SOT-23-3; Packing: Tape and Reel
R324 R325 = CMP-2002-01183-1: Part Number: ERT-J0ER103J; Manufacturer: Panasonic
R326 R327 R336 R347-R349 R383-R385 R388 = CMP-2002-08276-2: RES Thick Film, 1kΩ, 1%, 0.063W, 100ppm/°C, 0402; Resistance: 1kR; Power Rating: 63mW; Voltage Rating (DC): 50V; Package Quantity: 10; Termination: SMD/SMT; Width: 0.5mm; Military Standard: Not; Length: 1mm; Contact Plating: Tin; Mount: Surface Mount; Packaging: Tape and Reel; Case Code (Imperial): 0402; Tolerance: 1%; Weight: 2.3E-05oz; Number of Pins: 2; Case/Package: 0402; Case Code (Metric): 1005; Lead Free: Lead Free; Number of Terminations: 2; Max Power Dissipation: 63mW; Depth: 0.5mm; Temperature Coefficient: 100ppm/°C; Max Operating Temperature: 155°C; Height: 0.35mm; Features: Automotive AEC-Q200; Composition: Thick Film; Radiation Hardening: No; Voltage Rating: 50V; Min Operating Temperature: -55°C
R328 R332-R334 R341 R344 R350 R361 R362 R373-R380 R382 R387 R389 = CMP-2002-08122-2: RES Thick Film, 0Ω, 0.063W, 0402; Tolerance: 5%; Max Power Dissipation: 63mW; Voltage Rating: 50V; Temperature Coefficient: 100ppm/°C; Resistance: 0mR; Contact Plating: Tin; Height: 0.35mm; Radiation Hardening: No; Features: Automotive AEC-Q200; Composition: Thick Film; Width: 0.5mm; Weight: 2.3E-05oz; Termination: SMD/SMT; Packaging: Tape and Reel; Mount: Surface Mount; Case Code (Metric): 1005; Military Standard: Not; Min Operating Temperature: -55°C; Number of Terminations: 2; Package Quantity: 1; Case Code (Imperial): 0402; Depth: 0.5mm; Max Operating Temperature: 155°C; Case/Package: 0402; Power Rating: 63mW; Lead Free: Lead Free; Voltage Rating (DC): 50V; Length: 1mm
R329-R331 R335 R337-R340 R342 R343 R345 R354 R358 R360 R363 R368 = CMP-2002-00051-3: RES Thick Film, 4.7kΩ, 1%, 0.063W, 100ppm/°C, 0402; Voltage Rating (DC): 50V; Power Rating: 63mW; Resistance: 4.7kR; Termination: SMD/SMT; Military Standard: Not; Length: 1mm; Radiation Hardening: No; Max Operating Temperature: 155°C; Min Operating Temperature: -55°C; Package Quantity: 10; Width: 0.5mm; Case Code (Imperial): 0402; Number of Terminations: 2; Max Power Dissipation: 63mW; Tolerance: 1%; Features: Automotive AEC-Q200; Composition: Thick Film; Depth: 0.5mm; Mount: Surface Mount; Weight: 2.3E-05oz; Lead Free: Lead Free; Case/Package: 0402; Height: 0.35mm; Packaging: Tape and Reel; Temperature Coefficient: 100ppm/°C; Case Code (Metric): 1005; Voltage Rating: 50V; Contact Plating: Tin
R346 R355-R357 = CMP-2002-08136-3: RES Thick Film, 10kΩ, 5%, 0.063W, 200ppm/°C, 0402; Voltage Rating: 50V; Power Rating: 63mW; Resistance: 10kR; Military Standard: Not; Packaging: Tape and Reel; Case Code (Imperial): 0402; Min Operating Temperature: -55°C; Case Code (Metric): 1005; Case/Package: 0402; Temperature Coefficient: 200ppm/°C; Termination: SMD/SMT; Composition: Thick Film; Depth: 0.5mm; Number of Terminations: 2; Contact Plating: Tin; Height: 0.016inch; Width: 0.5mm; Max Operating Temperature: 155°C; Features: Automotive AEC-Q200; Length: 1mm; Radiation Hardening: No; Max Power Dissipation: 63mW; Mount: Surface Mount; Tolerance: 5%; Package Quantity: 1; Weight: 2.3E-05oz
R351-R353 R390 R392 = CMP-2002-01154-4: Chip Resistor, 4.7 KOhm, +/- 1%, 0.1 W, -55 to 155 degC, 0402 (1005 Metric), RoHS, Tape and Reel; PartNumber: ERJ-2RKF4701X; Voltage Rating: 50 V; Case\/Package: 0402; Power Rating: 100 mW; Height: 0.35 mm; Mounting Technology: Surface Mount; REACH SVHC: Yes; Resistance: 4.7 KOhm; Max Operating Temperature: 155 degC; ComponentLink1Description: Manufacturer URL; ComponentLink2Description: Datasheet; Pins: 2; PackageReference: 0402; Tolerance: 1%; Case Code (Imperial): 0402; Length: 1 mm; PackageDescription: 2-Pin Surface Mount Device, Body 1 x 0.5 mm; RoHSCompliant: true; Package Quantity: 1; Radiation Hardening: No; DatasheetVersion: 04/2015; Width: 0.5 mm; Case Code (Metric): 1005; Mount: Surface Mount; ComponentLink1URL: http://www.panasonic.com/; Min Operating Temperature: -55 degC; Packaging: Cut Tape; ComponentLink2URL: http://industrial.panasonic.com/cdbs/www-data/pdf/RDA0000/AOA0000C86.pdf
R359 = CMP-2002-08523-2: as R260-R264 on sheet Private_CPU_Power; Case/Package: 0402; Packaging: Tape and Reel; Width: 0.5mm; Case Code (Metric): 1005; Radiation Hardening: No; Military Standard: Not; Contact Plating: Tin; Temperature Coefficient: 100ppm/°C; Lead Free: Lead Free; Power Rating: 63mW; Voltage Rating: 50V; Tolerance: 1%; Features: Automotive AEC-Q200; Case Code (Imperial): 0402; Composition: Thick Film; Weight: 2.3E-05oz; Package Quantity: 10; Min Operating Temperature: -55°C; Height: 0.35mm; Length: 1mm; Termination: SMD/SMT; Number of Terminations: 2; Depth: 0.5mm; Max Operating Temperature: 155°C
R364 R365 = CMP-1011-00363-3: RES Thick Film, 49.9Ω, 1%, 0.063W, 100ppm/°C, 0402; Resistance: 49.9R; Voltage Rating: 50V; Power Rating: 63mW; Temperature Coefficient: 100ppm/°C; Packaging: Tape and Reel; Height: 0.35mm; Length: 1mm; Case Code (Metric): 1005; Weight: 2.3E-05oz; Case Code (Imperial): 0402; Voltage Rating (DC): 50V; Composition: Thick Film; Lead Free: Lead Free; Package Quantity: 10; Number of Terminations: 2; Width: 0.5mm; Max Operating Temperature: 155°C; Depth: 0.5mm; Max Power Dissipation: 63mW; Tolerance: 1%; Radiation Hardening: No; Features: Automotive AEC-Q200; Min Operating Temperature: -55°C; Contact Plating: Tin; Mount: Surface Mount; Military Standard: Not; Termination: SMD/SMT; Case/Package: 0402
R366 R367 = CMP-2002-08532-1: Part Number: CRCW040233R2FKED; Manufacturer: Vishay Dale
R369 R370 R381 R386 = CMP-2002-00270-2: RES Thick Film, 91kΩ, 1%, 0.063W, 100ppm/°C, 0402; Power Rating: 63mW; Voltage Rating: 50V; Resistance: 91kR; Packaging: Tape and Reel; Max Operating Temperature: 155°C; Height: 0.35mm; Radiation Hardening: No; Tolerance: 1%; Number of Terminations: 2; Width: 0.02inch; Length: 1mm; Temperature Coefficient: 100ppm/°C; Features: Automotive AEC-Q200; Voltage Rating (DC): 50V; Weight: 2.3E-05oz; Min Operating Temperature: -55°C; Military Standard: Not; Max Power Dissipation: 63mW; Number of Pins: 2; Composition: Thick Film; Lead Free: Lead Free; Contact Plating: Tin; Case/Package: 0402; Termination: SMD/SMT; Package Quantity: 10; Case Code (Metric): 1005; Case Code (Imperial): 0402; Depth: 0.5mm
R371 = CMP-2002-08143-1: as R258 on sheet Private_CPU_Power
R372 = CMP-2002-08529-1: Manufacturer: Vishay Dale; Part Number: CRCW040233K2FKED
R391 R393 = CMP-2000-00435-2: Chip Resistor, 330 Ohm, +/- 1%, 0.1 W, -55 to 155 degC, 0603 (1608 Metric), RoHS, Tape and Reel; Gender: Male; Mating Cycles: 10000; Current Rating: 500 mA; Voltage Rating: 10 V; REACH SVHC: No SVHC; PackageDescription: 2-Pin Surface Mount Device, Body 1.6 x 0.85 mm; Contact Finish: Gold; Pins: 8; ComponentLink1Description: Manufacturer URL; Packaging: Tape and Reel; Max Operating Temperature: 85 degC; Contact Material: Copper; Height: 1.45 mm; Width: 1.45 mm; DatasheetVersion: Apr-15; Package Quantity: 1500; Contact Plating: Gold; PackageReference: 0603; Mount: Surface Mount; Lead Pitch: 1.1 mm; Min Operating Temperature: -25 degC; ComponentLink1URL: http://www.panasonic.com/; ComponentLink2URL: http://industrial.panasonic.com/cdbs/www-data/pdf/RDA0000/AOA0000C86.pdf; Length: 13.7 mm; ComponentLink2Description: Datasheet; RoHSCompliant: true
SW2 = CMP-2000-06884-2: SWITCH SLIDE SPDT 300MA 6V; Actuator Material: Nylon; Switch Function: On-On; Insulation Resistance: 100mR; Actuator Type: Standard; Mechanical Life: 10000Cycles; Actuator Length: 1.5mm; Contact Resistance: 70mR; Min Operating Temperature: -20°C; Max Current Rating: 300mA; Max Voltage Rating (DC): 6V; Package Quantity: 1; Mount: Surface Mount; Packaging: Tape and Reel; Contact Plating: Silver; Depth: 5mm; REACH SVHC: No SVHC; Voltage Rating (DC): 6V; Voltage Rating (AC): 6V; Max Operating Temperature: 85°C; Length: 7.7mm; Termination: Gull Wing; Current Rating: 300mA; Contact Current Rating: 300mA; Orientation: Right Angle; Width: 6.7mm; Switch Travel: 1.5mm; Lead Free: Lead Free; Contact Material: Copper Alloy; Throw Configuration: SPDT
U8 U9 = CMP-0859-00406-3: Single Buffer/Driver With Open-Drain Output, DCK0005A, SMALL T&R; Manufacturer: Texas Instruments; Input Type: CMOS; F @ Nom Voltage(Max)(Mhz): 250; Rating: Catalog; Bits(#): 1; Schmitt Trigger: No; VCC(Min)(V): 0.8; tpd @ Nom Voltage(Max)(ns): 4.7,3.3,2.4,2.3,1.8; Output Drive (IOL/IOH)(Max)(mA): 9/-9; VCC(Max)(V): 2.7; Technology Family: AUC; ICC @ Nom Voltage(Max)(mA): 0.01; Voltage(Nom)(V): 0.8,1.2,1.5,1.8,2.5; Sub-Family: Non-Inverting Buffer/Driver; Logic: True; DatasheetVersion: SCES373Q; 3-State Output: No; Operating Temperature Range(C): -40 to 85; Generic Part Number: SN74AUC1G07; PackageReference: DCK0005A; Output Type: CMOS
U10 = CMP-0859-00960-3: Single Buffer/Driver With Open-Drain Output, DSF0006A, LARGE T&R; Manufacturer: Texas Instruments; Output Type: CMOS; 3-State Output: No; F @ Nom Voltage(Max)(Mhz): 150; Bits(#): 1; Rating: Catalog; Voltage(Nom)(V): 1.8,2.5,3.3,5; Sub-Family: Non-Inverting Buffer/Driver; Input Type: CMOS/TTL; VCC(Max)(V): 5.5; Logic: True; VCC(Min)(V): 1.65; Output Drive (IOL/IOH)(Max)(mA): 32/-32; ICC @ Nom Voltage(Max)(mA): 0.01; Technology Family: LVC; tpd @ Nom Voltage(Max)(ns): 8.6,6,4.7,4; Schmitt Trigger: No; Operating Temperature Range(C): -40 to 125,-40 to 85; DatasheetVersion: SCES296AC; Generic Part Number: SN74LVC1G07; PackageReference: DSF0006A
Y6 = ECS-3518-1000-B-TR: subminiature SMD oscillators; MF: {'manufacturer': u'ECS Inc.'}; Price: None; MP: ECS-3518-1000-B-TR; Availability: Unavailable; Value: *; Package: None
Y7 = ASVMB-2.048MHZ-ER-T: Crystal or Oscillator; Manufacturer_Name: ABRACON; Datasheet Link: https://abracon.com/Oscillators/ASVMB.pdf; Height: 0.9mm; Manufacturer_Part_Number: ASVMB-2.048MHZ-ER-T

## Sheet Private_CPU_IO.SchDoc
size D
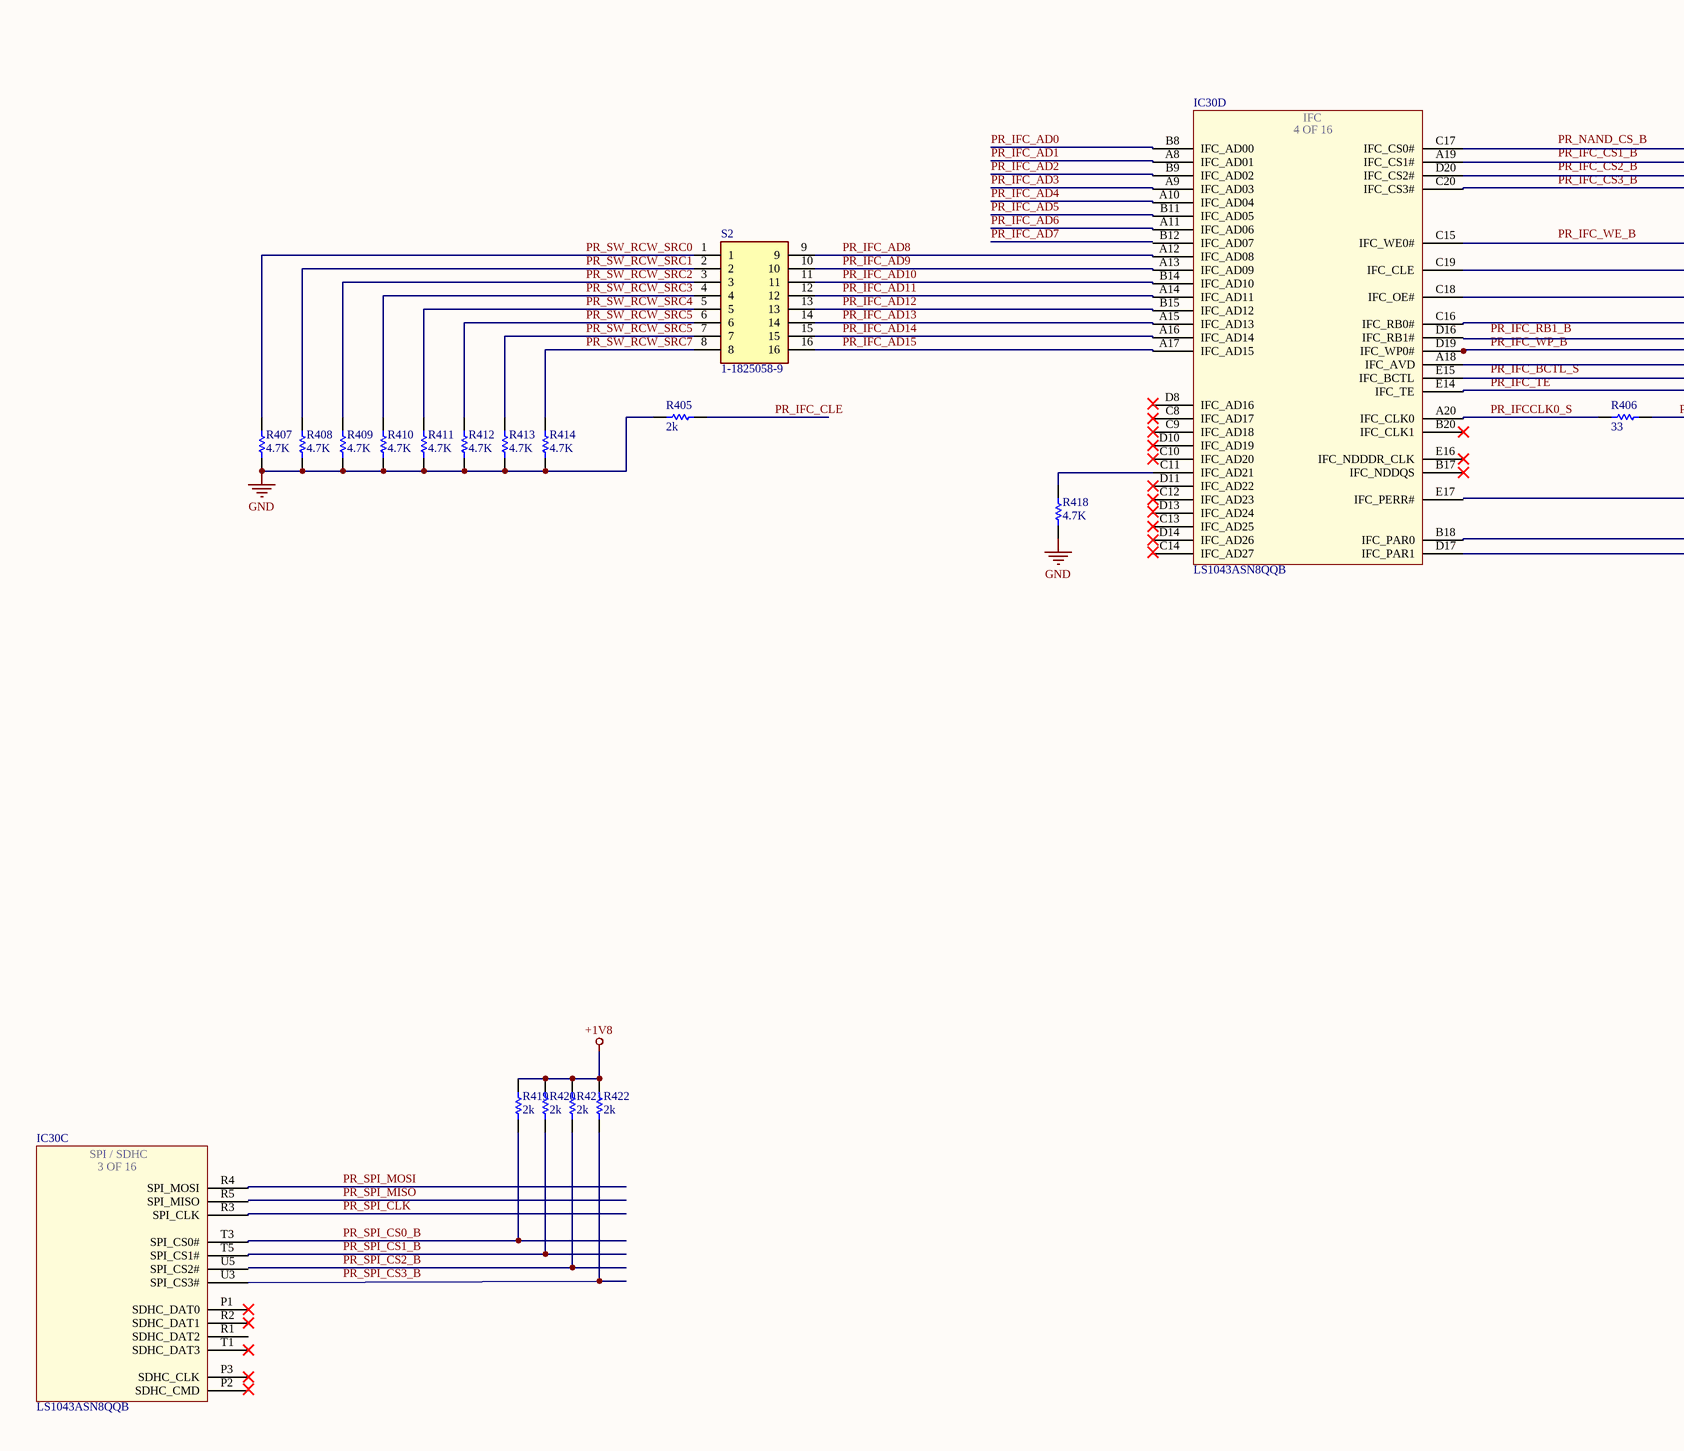
[diagram p36: Private_CPU_IO.SchDoc, left]
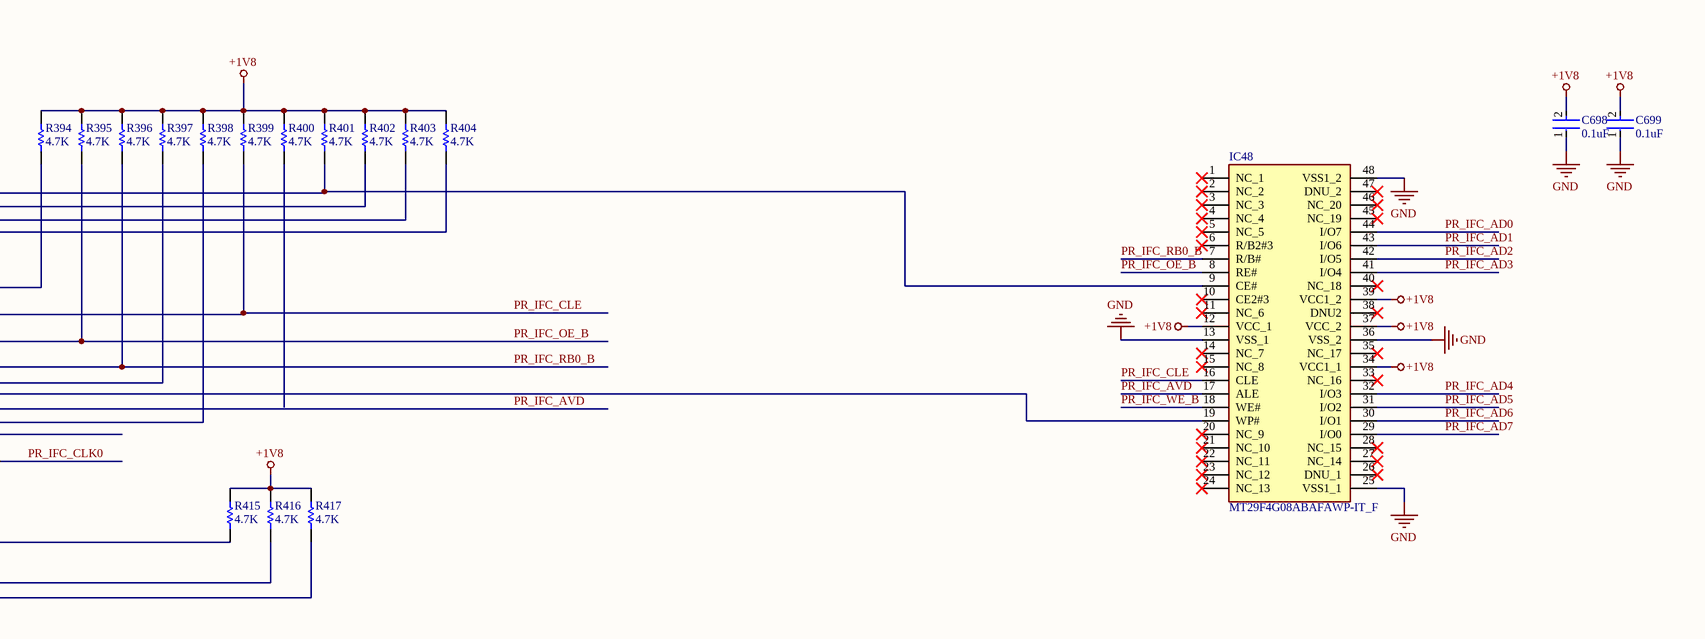
[diagram p37: Private_CPU_IO.SchDoc, right]

### Parts
C698  0.1uF  [FP-GRM15-MFG]
C699  0.1uF  [FP-GRM15-MFG]
IC30  LS1043ASN8QQB  [BGA780C80P28X28_2300X2300X261]  (parts C,D of 16)
IC48  MT29F4G08ABAFAWP-IT_F  [SOP50P2000X120-48N]
R394  4.7K  [RESC1005X40X25LL05T05]
R395  4.7K  [RESC1005X40X25LL05T05]
R396  4.7K  [RESC1005X40X25LL05T05]
R397  4.7K  [RESC1005X40X25LL05T05]
R398  4.7K  [RESC1005X40X25LL05T05]
R399  4.7K  [RESC1005X40X25LL05T05]
R400  4.7K  [RESC1005X40X25LL05T05]
R401  4.7K  [RESC1005X40X25LL05T05]
R402  4.7K  [RESC1005X40X25LL05T05]
R403  4.7K  [RESC1005X40X25LL05T05]
R404  4.7K  [RESC1005X40X25LL05T05]
R405  2k  [RESC1005X40X25NL05T05]
R406  33  [RESC1005X40X25LL05T05]
R407  4.7K  [RESC1005X40X25LL05T05]
R408  4.7K  [RESC1005X40X25LL05T05]
R409  4.7K  [RESC1005X40X25LL05T05]
R410  4.7K  [RESC1005X40X25LL05T05]
R411  4.7K  [RESC1005X40X25LL05T05]
R412  4.7K  [RESC1005X40X25LL05T05]
R413  4.7K  [RESC1005X40X25LL05T05]
R414  4.7K  [RESC1005X40X25LL05T05]
R415  4.7K  [RESC1005X40X25LL05T05]
R416  4.7K  [RESC1005X40X25LL05T05]
R417  4.7K  [RESC1005X40X25LL05T05]
R418  4.7K  [RESC1005X40X25LL05T05]
R419  2k  [RESC1005X40X25NL05T05]
R420  2k  [RESC1005X40X25NL05T05]
R421  2k  [RESC1005X40X25NL05T05]
R422  2k  [RESC1005X40X25NL05T05]
S2  1-1825058-9  [118250589]

### Nets
+1V8: C698.2 C699.2 IC48.12(VCC_1) IC48.34(VCC1_1) IC48.37(VCC_2) IC48.39(VCC1_2) R394.2 R395.2 R396.2 R397.2 R398.2 R399.2 R400.2 R401.2 R402.2 R403.2 R404.2 R415.2 R416.2 R417.2 R419.1 R420.1 R421.1 R422.1
GND: C698.1 C699.1 IC48.13(VSS_1) IC48.25(VSS1_1) IC48.36(VSS_2) IC48.48(VSS1_2) R405.2 R407.1 R408.1 R409.1 R410.1 R411.1 R412.1 R413.1 R414.1 R418.1
PR_IFC_AD0: IC30.B8(IFC_AD00) IC48.44(I/O7)
PR_IFC_AD1: IC30.A8(IFC_AD01) IC48.43(I/O6)
PR_IFC_AD2: IC30.B9(IFC_AD02) IC48.42(I/O5)
PR_IFC_AD3: IC30.A9(IFC_AD03) IC48.41(I/O4)
PR_IFC_AD4: IC30.A10(IFC_AD04) IC48.32(I/O3)
PR_IFC_AD5: IC30.B11(IFC_AD05) IC48.31(I/O2)
PR_IFC_AD6: IC30.A11(IFC_AD06) IC48.30(I/O1)
PR_IFC_AD7: IC48.29(I/O0)
PR_IFC_AD8: IC30.A12(IFC_AD08) S2.9
PR_IFC_AD9: IC30.A13(IFC_AD09) S2.10
PR_IFC_AD10: IC30.B14(IFC_AD10) S2.11
PR_IFC_AD11: IC30.A14(IFC_AD11) S2.12
PR_IFC_AD12: IC30.B15(IFC_AD12) S2.13
PR_IFC_AD13: IC30.A15(IFC_AD13) S2.14
PR_IFC_AD14: IC30.A16(IFC_AD14) S2.15
PR_IFC_AD15: IC30.A17(IFC_AD15) S2.16
PR_IFC_AVD: IC30.A18(IFC_AVD) IC48.17(ALE)
PR_IFC_CLE: IC30.C19(IFC_CLE) IC48.16(CLE) R399.1 R405.1
PR_IFC_CLK0: R406.2
PR_IFC_CS3_B: IC30.C20(IFC_CS3#) R404.1
PR_IFC_OE_B: IC30.C18(IFC_OE#) IC48.8(RE#) R395.1
PR_IFC_RB0_B: IC30.C16(IFC_RB0#) IC48.7(R/B#) R396.1
PR_IFC_TE: IC30.E14(IFC_TE)
PR_IFC_WE_B: IC48.18(WE#)
PR_IFC_WP_B: IC30.D19(IFC_WP0#) IC48.19(WP#)
PR_IFCCLK0_S: IC30.A20(IFC_CLK0) R406.1
PR_SPI_CLK: IC30.R3(SPI_CLK)
PR_SPI_CS0_B: IC30.T3(SPI_CS0#) R419.2
PR_SPI_CS1_B: IC30.T5(SPI_CS1#) R420.2
PR_SPI_CS2_B: R421.2
PR_SPI_MOSI: IC30.R4(SPI_MOSI)
PR_SW_RCW_SRC0: R407.2 S2.1
PR_SW_RCW_SRC1: R408.2 S2.2
PR_SW_RCW_SRC2: R409.2 S2.3
PR_SW_RCW_SRC3: R410.2 S2.4
PR_SW_RCW_SRC4: R411.2 S2.5
PR_SW_RCW_SRC5: R412.2 R413.2 S2.6 S2.7
PR_SW_RCW_SRC7: R414.2 S2.8
NetIC30_A19: IC30.A19(IFC_CS1#) R402.1
NetIC30_B18: IC30.B18(IFC_PAR0) R416.1
NetIC30_C11: IC30.C11(IFC_AD21) R418.2
NetIC30_C15: IC30.C15(IFC_WE0#) R394.1
NetIC30_C17: IC30.C17(IFC_CS0#) IC48.9(CE#) R401.1
NetIC30_D17: IC30.D17(IFC_PAR1) R417.1
NetIC30_D20: IC30.D20(IFC_CS2#) R403.1
NetIC30_E15: IC30.E15(IFC_BCTL) R398.1
NetIC30_U3: IC30.U3(SPI_CS3#) R422.2

Not connected (* = marked no-connect by the designer): IC30 B12(IFC_AD07) B17(IFC_NDDQS)* B20(IFC_CLK1)* C8(IFC_AD17)* C9(IFC_AD18)* C10(IFC_AD20)* C12(IFC_AD23)* C13(IFC_AD25)* C14(IFC_AD27) D8(IFC_AD16) D10(IFC_AD19)* D11(IFC_AD22)* D13(IFC_AD24) D14(IFC_AD26)* D16(IFC_RB1#) E16(IFC_NDDDR_CLK)* E17(IFC_PERR#) P1(SDHC_DAT0)* P2(SDHC_CMD) P3(SDHC_CLK)* R1(SDHC_DAT2) R2(SDHC_DAT1)* R5(SPI_MISO) T1(SDHC_DAT3)* U5(SPI_CS2#); IC48 1(NC_1)* 2(NC_2)* 3(NC_3)* 4(NC_4)* 5(NC_5)* 6(R/B2#3)* 10(CE2#3)* 11(NC_6)* 14(NC_7)* 15(NC_8)* 20(NC_9)* 21(NC_10)* 22(NC_11)* 23(NC_12)* 24(NC_13)* 26(DNU_1)* 27(NC_14)* 28(NC_15)* 33(NC_16)* 35(NC_17)* 38(DNU2)* 40(NC_18)* 45(NC_19)* 46(NC_20)* 47(DNU_2)*; R397 1; R400 1; R415 1

### Notes on the sheet
- Labels drawn without touching a wire or pin: PR_IFC_BCTL_S, PR_IFC_CS1_B, PR_IFC_CS2_B, PR_IFC_RB1_B, PR_IFC_WE_B, PR_NAND_CS_B, PR_SPI_CS3_B
- Title
- Size:
- Date:
- File:
- D
- Number:
- Time:
- Revision:
- Sheet
- of
- (in symbol LS1043ASN8QQB, part C) SPI / SDHC; 3 OF 16
- (in symbol LS1043ASN8QQB, part D) IFC; 4 OF 16

### Library data of the parts
C698 C699 = CMP-2100-03641-2: as C391 on sheet Private_CPU_Power; RoHS: TRUE; Temperature Characteristic: X7R; Octopart: https://octopart.com/grm155r71c104ka88d-murata-196880; Digikey Description: CAP CER 0.1UF 16V X7R 0402; Device Class L3: Ceramic Capacitors; Height: 0.55mm; ComponentLink2Description: Datasheet; Temperature Range Low: -55°C; Ipc Land Pattern Name: CAPC10050X219; ComponentLink2URL: https://search.murata.co.jp/Ceramy/image/img/A01X/G101/ENG/GRM155R71H471KA01-01A.pdf; Device Class L1: Passive Components; Lead Free: yes; Category: Cap; Package: GRM15; Temperature: -55°C to +125°C; Device Class L2: Capacitors; Temperature Range High: +125°C; Mouser Description: 0402 0.1 uF 16V ±10 % Tolerance X7R SMT Multilayer Ceramic Capacitor
IC30 = LS1043ASN8QQB: as IC30 on sheet Private_CPU_Power; Datasheet Link: http://www.nxp.com/secured/assets/documents/en/data-sheet/LS1088A.pdf; Height: 2.61mm; Manufacturer_Part_Number: LS1043ASN8QQB; Mouser Part Number: 771-LS1043ASN8QQB; Mouser Price/Stock: https://www.mouser.co.uk/ProductDetail/NXP-Semiconductors/LS1043ASN8QQB/?qs=AQlKX63v8RsTATOTx7X0Jg%3D%3D
IC48 = MT29F4G08ABAFAWP-IT_F: Integrated Circuit; Manufacturer_Name: Micron; Manufacturer_Part_Number: MT29F4G08ABAFAWP-IT:F; Datasheet Link: https://componentsearchengine.com/Datasheets/2/MT29F4G08ABAFAWP-IT_F.pdf; Height: 1.2mm; Mouser Part Number: 340-371016-TRAY; Mouser Price/Stock: https://www.mouser.co.uk/ProductDetail/Micron/MT29F4G08ABAFAWP-ITF/?qs=0lSvoLzn4L9J4k7jmg5qkQ%3D%3D; Arrow Part Number: MT29F4G08ABAFAWP-IT:F; Arrow Price/Stock: https://www.arrow.com/en/products/mt29f4g08abafawp-itf/micron-technology
R394-R404 R407-R418 = CMP-2002-01154-4: as R351-R353 on sheet Private_CPU_Reset_IO; Height: 0.35 mm; Mounting Technology: Surface Mount; REACH SVHC: Yes; Resistance: 4.7 KOhm; Max Operating Temperature: 155 degC; ComponentLink1Description: Manufacturer URL; ComponentLink2Description: Datasheet; Pins: 2; PackageReference: 0402; Tolerance: 1%; Case Code (Imperial): 0402; Length: 1 mm; PackageDescription: 2-Pin Surface Mount Device, Body 1 x 0.5 mm; RoHSCompliant: true; Package Quantity: 1; Radiation Hardening: No; DatasheetVersion: 04/2015; Width: 0.5 mm; Case Code (Metric): 1005; Mount: Surface Mount; ComponentLink1URL: http://www.panasonic.com/; Min Operating Temperature: -55 degC; Packaging: Cut Tape; ComponentLink2URL: http://industrial.panasonic.com/cdbs/www-data/pdf/RDA0000/AOA0000C86.pdf
R405 R419-R422 = CMP-2002-00758-3: Chip Resistor, 2 KOhm, +/- 1%, 100 mW, -55 to 155 degC, 0402 (1005 Metric), RoHS, Tape and Reel; Manufacturer: Basic Passives; PartNumber: ERJ-2RKF2001X; Power Rating: 100 mW; Voltage Rating: 50 V; Case\/Package: 0402; Resistance: 2 KOhm; Packaging: Tape and Reel; Tolerance: 1%; PackageReference: 0402; Package Quantity: 10000; ComponentLink1URL: http://www.panasonic.com/; Min Operating Temperature: -55 degC; DatasheetVersion: 04/2015; Case Code (Imperial): 0402; PackageDescription: 2-Pin Surface Mount Device, Body 1 x 0.5 mm; Height: 0.35 mm; Pins: 2; Mount: Surface Mount; Radiation Hardening: No; ComponentLink1Description: Manufacturer URL; ComponentLink2Description: Datasheet; Max Operating Temperature: 155 degC; Case Code (Metric): 1005; Length: 1 mm; RoHSCompliant: true; Mounting Technology: Surface Mount; Width: 0.5 mm; ComponentLink2URL: http://industrial.panasonic.com/cdbs/www-data/pdf/RDA0000/AOA0000C86.pdf; REACH SVHC: Unknown
R406 = CMP-2002-01146-1: Manufacturer: Panasonic; Part Number: ERJ2RKF33R0X
S2 = 1-1825058-9: Switch; Manufacturer_Name: TE Connectivity; Datasheet Link: http://www.te.com/commerce/DocumentDelivery/DDEController?Action=showdoc&DocId=Customer+Drawing%7F1825058%7FS4%7Fpdf%7FEnglish%7FENG_CD_1825058_S4.pdf%7F1-1825058-9; Height: 3mm; Manufacturer_Part_Number: 1-1825058-9; Arrow Part Number: 1-1825058-9; Arrow Price/Stock: https://www.arrow.com/en/products/1-1825058-9/te-connectivity

## Sheet Private_CPU_USB.SchDoc
size D
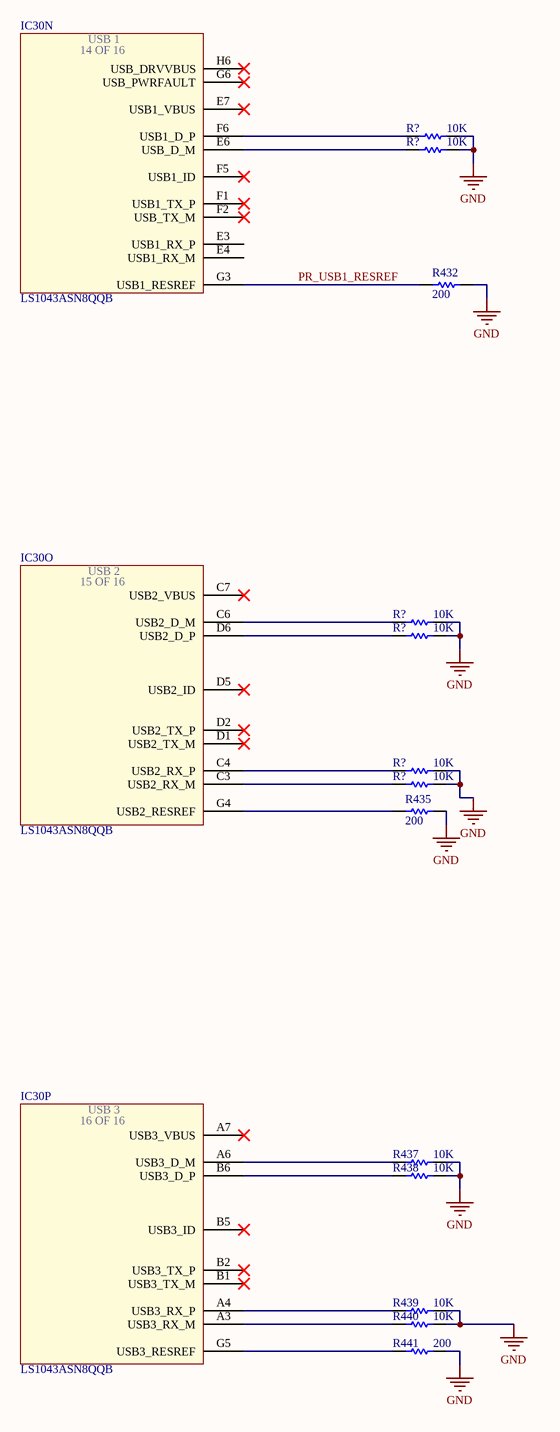
[diagram p38: Private_CPU_USB.SchDoc]

### Parts
(Parts that share a designator on the sheet are numbered #1, #2 ... from top to bottom, then left to right.)
IC30  LS1043ASN8QQB  [BGA780C80P28X28_2300X2300X261]  (parts N,O,P of 16)
R432  200  [RESC1005X40X25ML05T05]
R435  200  [RESC1005X40X25ML05T05]
R437  10K  [RESC1005X40X25LL05T10]
R438  10K  [RESC1005X40X25LL05T10]
R439  10K  [RESC1005X40X25LL05T10]
R440  10K  [RESC1005X40X25LL05T10]
R441  200  [RESC1005X40X25ML05T05]
R?#7  10K  [RESC1005X40X25LL05T10]
R?#8  10K  [RESC1005X40X25LL05T10]
R?#9  10K  [RESC1005X40X25LL05T10]
R?#10  10K  [RESC1005X40X25LL05T10]
R?#11  10K  [RESC1005X40X25LL05T10]
R?#12  10K  [RESC1005X40X25LL05T10]

### Nets
GND: R432.2 R435.2 R437.2 R438.2 R439.2 R440.2 R441.2 R?#7.2 R?#8.2 R?#9.2 R?#10.2 R?#11.2 R?#12.2
PR_USB1_RESREF: IC30.G3(USB1_RESREF) R432.1
NetIC30_A3: IC30.A3(USB3_RX_M) R440.1
NetIC30_A4: IC30.A4(USB3_RX_P) R439.1
NetIC30_A6: IC30.A6(USB3_D_M) R437.1
NetIC30_B6: IC30.B6(USB3_D_P) R438.1
NetIC30_C3: IC30.C3(USB2_RX_M) R?#12.1
NetIC30_C4: IC30.C4(USB2_RX_P) R?#11.1
NetIC30_C6: IC30.C6(USB2_D_M) R?#9.1
NetIC30_D6: IC30.D6(USB2_D_P) R?#10.1
NetIC30_E6: IC30.E6(USB_D_M) R?#8.1
NetIC30_F6: IC30.F6(USB1_D_P) R?#7.1
NetIC30_G4: IC30.G4(USB2_RESREF) R435.1
NetIC30_G5: IC30.G5(USB3_RESREF) R441.1

Not connected (* = marked no-connect by the designer): IC30 A7(USB3_VBUS)* B1(USB3_TX_M)* B2(USB3_TX_P)* B5(USB3_ID)* C7(USB2_VBUS)* D1(USB2_TX_M)* D2(USB2_TX_P)* D5(USB2_ID)* E3(USB1_RX_P) E4(USB1_RX_M) E7(USB1_VBUS)* F1(USB1_TX_P)* F2(USB_TX_M)* F5(USB1_ID)* G6(USB_PWRFAULT)* H6(USB_DRVVBUS)*

### Notes on the sheet
- Title
- Size:
- Date:
- File:
- D
- Number:
- Time:
- Revision:
- Sheet
- of
- (in symbol LS1043ASN8QQB, part N) USB 1; 14 OF 16
- (in symbol LS1043ASN8QQB, part O) USB 2; 15 OF 16
- (in symbol LS1043ASN8QQB, part P) USB 3; 16 OF 16

### Library data of the parts
IC30 = LS1043ASN8QQB: as IC30 on sheet Private_CPU_Power; Datasheet Link: http://www.nxp.com/secured/assets/documents/en/data-sheet/LS1088A.pdf; Height: 2.61mm; Manufacturer_Part_Number: LS1043ASN8QQB; Mouser Part Number: 771-LS1043ASN8QQB; Mouser Price/Stock: https://www.mouser.co.uk/ProductDetail/NXP-Semiconductors/LS1043ASN8QQB/?qs=AQlKX63v8RsTATOTx7X0Jg%3D%3D
R432 R435 R441 = CMP-2002-08353-1: Part Number: CRCW0402200RJNED; Manufacturer: Vishay Dale
R437-R440 R?#7-R?#12 = CMP-2002-07353-1: Part Number: RC0402FR-0710KL; Manufacturer: Yageo / Phycomp